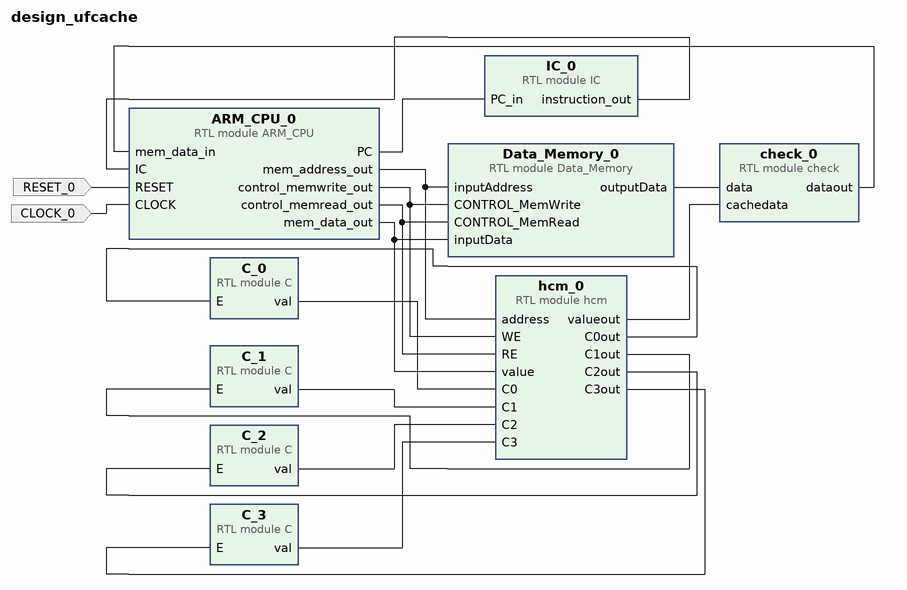
[diagram p0: block diagram of the top level]
# Vivado block design design_ufcache, xc7a100tcsg324-1, Vivado 2018.3
create_bd_design design_ufcache

create_bd_port -dir I -type rst RESET_0
create_bd_port -dir I -type clk CLOCK_0

create_bd_cell -type module -reference ARM_CPU ARM_CPU_0
create_bd_cell -type module -reference Data_Memory Data_Memory_0
create_bd_cell -type module -reference IC IC_0
create_bd_cell -type module -reference check check_0
create_bd_cell -type module -reference hcm hcm_0
create_bd_cell -type module -reference C C_0
create_bd_cell -type module -reference C C_1
create_bd_cell -type module -reference C C_2
create_bd_cell -type module -reference C C_3

# ---- connections ----

connect_bd_net [get_bd_pins IC_0/instruction_out] [get_bd_pins ARM_CPU_0/IC]
connect_bd_net [get_bd_pins ARM_CPU_0/PC] [get_bd_pins IC_0/PC_in]
connect_bd_net [get_bd_pins ARM_CPU_0/mem_address_out] [get_bd_pins Data_Memory_0/inputAddress] [get_bd_pins hcm_0/address]
connect_bd_net [get_bd_pins ARM_CPU_0/control_memwrite_out] [get_bd_pins Data_Memory_0/CONTROL_MemWrite] [get_bd_pins hcm_0/WE]
connect_bd_net [get_bd_pins ARM_CPU_0/control_memread_out] [get_bd_pins Data_Memory_0/CONTROL_MemRead] [get_bd_pins hcm_0/RE]
connect_bd_net -net RESET_0_1 [get_bd_ports RESET_0] [get_bd_pins ARM_CPU_0/RESET]
connect_bd_net -net CLOCK_0_1 [get_bd_ports CLOCK_0] [get_bd_pins ARM_CPU_0/CLOCK]
connect_bd_net [get_bd_pins ARM_CPU_0/mem_data_out] [get_bd_pins Data_Memory_0/inputData] [get_bd_pins hcm_0/value]
connect_bd_net [get_bd_pins Data_Memory_0/outputData] [get_bd_pins check_0/data]
connect_bd_net [get_bd_pins check_0/dataout] [get_bd_pins ARM_CPU_0/mem_data_in]
connect_bd_net [get_bd_pins C_0/val] [get_bd_pins hcm_0/C0]
connect_bd_net [get_bd_pins C_1/val] [get_bd_pins hcm_0/C1]
connect_bd_net [get_bd_pins C_2/val] [get_bd_pins hcm_0/C2]
connect_bd_net [get_bd_pins C_3/val] [get_bd_pins hcm_0/C3]
connect_bd_net [get_bd_pins hcm_0/valueout] [get_bd_pins check_0/cachedata]
connect_bd_net [get_bd_pins hcm_0/C0out] [get_bd_pins C_0/E]
connect_bd_net [get_bd_pins hcm_0/C1out] [get_bd_pins C_1/E]
connect_bd_net [get_bd_pins hcm_0/C2out] [get_bd_pins C_2/E]
connect_bd_net [get_bd_pins hcm_0/C3out] [get_bd_pins C_3/E]

validate_bd_design
save_bd_design
